# Altium schematic sheet m4_debug.SchDoc
size A4
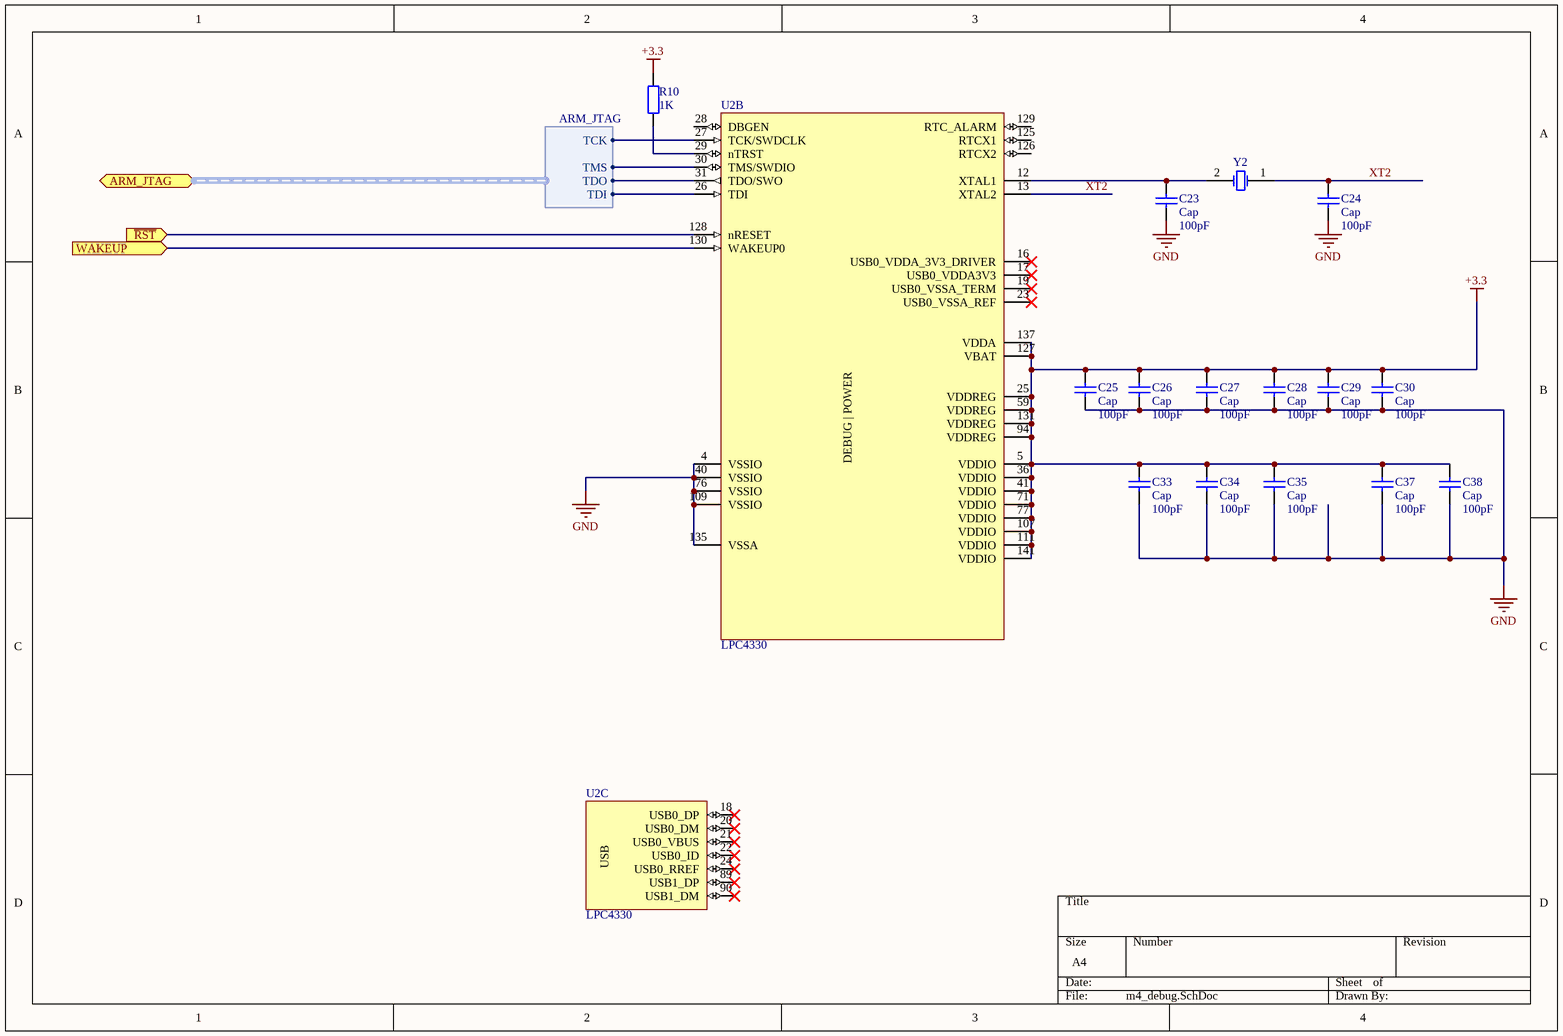
[diagram p0: m4_debug.SchDoc]

## Parts
C23  Cap  value 100pF  [C0603]
C24  Cap  value 100pF  [C0603]
C25  Cap  value 100pF  [C0603]
C26  Cap  value 100pF  [C0603]
C27  Cap  value 100pF  [C0603]
C28  Cap  value 100pF  [C0603]
C29  Cap  value 100pF  [C0603]
C30  Cap  value 100pF  [C0603]
C33  Cap  value 100pF  [C0603]
C34  Cap  value 100pF  [C0603]
C35  Cap  value 100pF  [C0603]
C37  Cap  value 100pF  [C0603]
C38  Cap  value 100pF  [C0603]
R10  value 1K  [R0603]  (hidden comment: Res2)
U2  LPC4330  [TSQFP50P2200X2200X160-144N]  (parts B,C of 5)
Y2  XTAL  [C3E-24.000-12-3030-X]  (value not drawn)

## Ports
ARM_JTAG (harness ARM_JTAG), WAKEUP (in), ~{RST} (in)

## Harnesses
ARM_JTAG: TCK, TDI, TDO, TMS

## Nets
+3.3: C25.1 C26.1 C27.1 C28.1 C29.1 C30.1 C33.1 C34.1 C35.1 C37.1 C38.1 R10.2 U2.5(VDDIO) U2.25(VDDREG) U2.36(VDDIO) U2.41(VDDIO) U2.59(VDDREG) U2.71(VDDIO) U2.77(VDDIO) U2.94(VDDREG) U2.107(VDDIO) U2.111(VDDIO) U2.127(VBAT) U2.131(VDDREG) U2.137(VDDA) U2.141(VDDIO)
GND: C23.1 C24.1 C25.2 C26.2 C27.2 C28.2 C29.2 C30.2 C33.2 C34.2 C35.2 C37.2 C38.2 U2.4(VSSIO) U2.40(VSSIO) U2.76(VSSIO) U2.109(VSSIO) U2.135(VSSA)
~{RST}: U2.128(nRESET) ; port ~{RST}
WAKEUP: U2.130(WAKEUP0) ; port WAKEUP
XT2: C24.2 U2.13(XTAL2) Y2.1(OSC1)
NetC23_2: C23.2 U2.12(XTAL1) Y2.2(OSC2)
NetR10_1: R10.1 U2.29(nTRST)
NetU2_26: U2.26(TDI) ; port ARM_JTAG.TDI
NetU2_27: U2.27(TCK/SWDCLK) ; port ARM_JTAG.TCK
NetU2_30: U2.30(TMS/SWDIO) ; port ARM_JTAG.TMS
NetU2_31: U2.31(TDO/SWO) ; port ARM_JTAG.TDO

Not connected (* = marked no-connect by the designer): U2 16(USB0_VDDA_3V3_DRIVER)* 17(USB0_VDDA3V3)* 18(USB0_DP)* 19(USB0_VSSA_TERM)* 20(USB0_DM)* 21(USB0_VBUS)* 22(USB0_ID)* 23(USB0_VSSA_REF)* 24(USB0_RREF)* 28(DBGEN) 89(USB1_DP)* 90(USB1_DM)* 125(RTCX1) 126(RTCX2) 129(RTC_ALARM)

## Notes on the sheet
- (in symbol LPC4330, part B) DEBUG | POWER
- (in symbol LPC4330, part C) USB

## Library data of the parts
C23-C30 C33-C35 C37 C38 = Cap: Capacitor; Published: 8-Jun-2000; LatestRevisionDate: 17-Jul-2002; LatestRevisionNote: Re-released for DXP Platform.; PackageReference: RAD-0.3; Publisher: Altium Limited
R10 = Res2: Resistor; Published: 8-Jun-2000; LatestRevisionDate: 17-Jul-2002; LatestRevisionNote: Re-released for DXP Platform.; PackageReference: AXIAL-0.4; Publisher: Altium Limited
U2 = LPC4330: MCU, 32BIT, ARM CORTEX M4&M0, 144LQFP; farnell: 2094316
Y2 = XTAL: Crystal Oscillator; Published: 8-Jun-2000; LatestRevisionDate: 17-Jul-2002; LatestRevisionNote: Re-released for DXP Platform.; PackageReference: R38; Publisher: Altium Limited